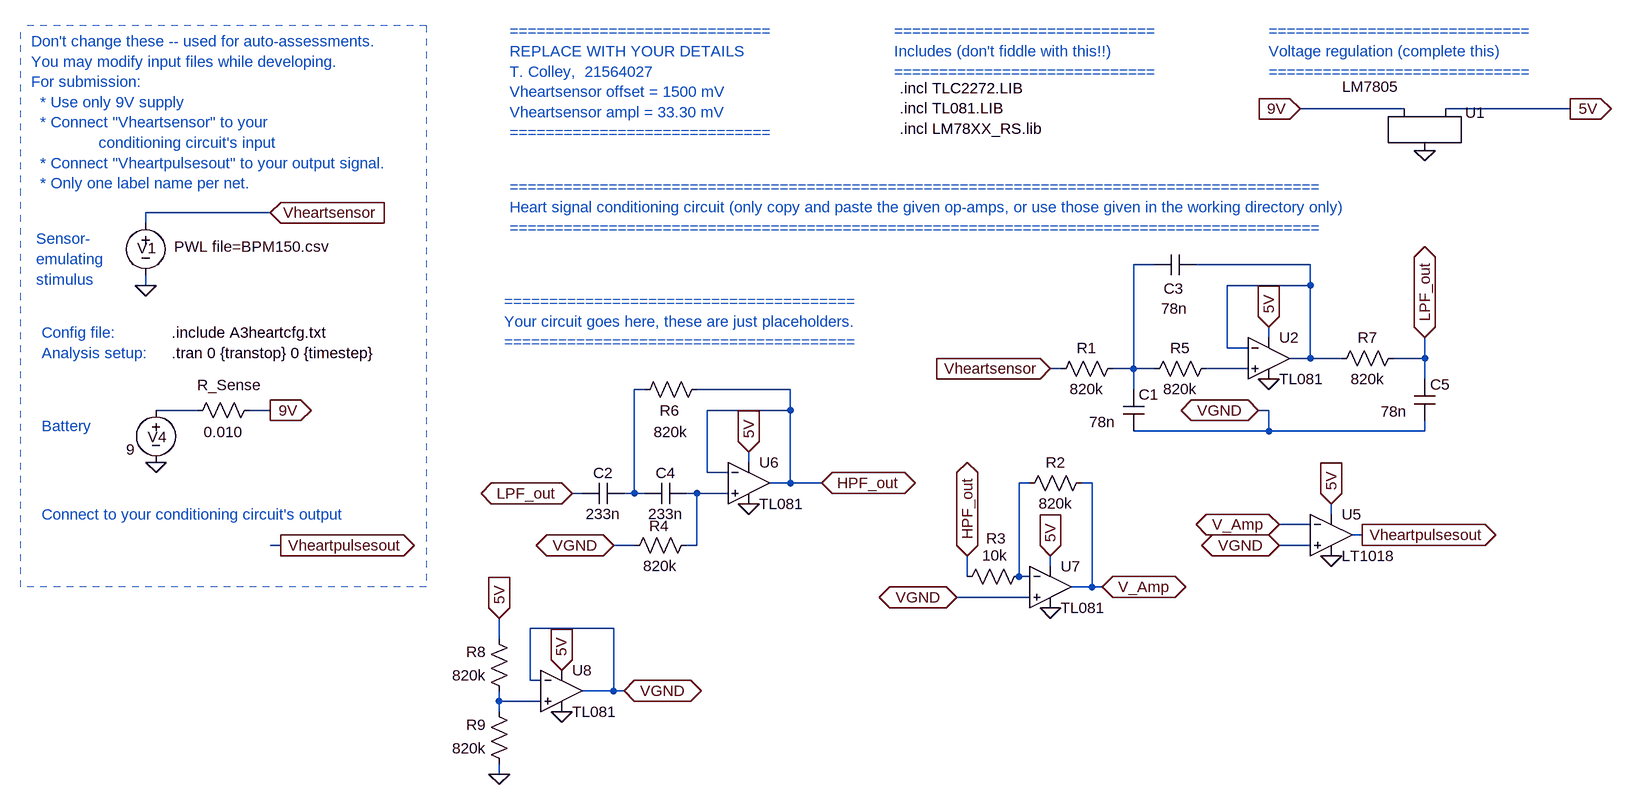
[diagram p0: schematic E344_A3_heart.asc]
E344_A3_heart.asc, the LTspice schematic file:
Version 4
SHEET 1 1824 680
WIRE -176 -1280 -336 -1280
WIRE 80 -1280 -112 -1280
WIRE -1920 -1120 -2112 -1120
WIRE -2112 -1104 -2112 -1120
WIRE -560 -1040 -592 -1040
WIRE -320 -1040 -496 -1040
WIRE -2112 -1008 -2112 -1024
WIRE -320 -1008 -320 -1040
WIRE -320 -1008 -448 -1008
WIRE -384 -928 -384 -944
WIRE -448 -912 -448 -1008
WIRE -416 -912 -448 -912
WIRE -320 -896 -320 -1008
WIRE -320 -896 -352 -896
WIRE -272 -896 -320 -896
WIRE -144 -896 -144 -928
WIRE -144 -896 -192 -896
WIRE -704 -880 -720 -880
WIRE -592 -880 -592 -1040
WIRE -592 -880 -624 -880
WIRE -560 -880 -592 -880
WIRE -416 -880 -480 -880
WIRE -144 -864 -144 -896
WIRE -1344 -848 -1360 -848
WIRE -1120 -848 -1264 -848
WIRE -592 -848 -592 -880
WIRE -2032 -816 -2096 -816
WIRE -1920 -816 -1952 -816
WIRE -1120 -816 -1120 -848
WIRE -1120 -816 -1248 -816
WIRE -384 -816 -400 -816
WIRE -384 -784 -384 -816
WIRE -384 -784 -592 -784
WIRE -144 -784 -144 -800
WIRE -144 -784 -384 -784
WIRE -1184 -736 -1184 -752
WIRE -1248 -720 -1248 -816
WIRE -1216 -720 -1248 -720
WIRE -1120 -704 -1120 -816
WIRE -1120 -704 -1152 -704
WIRE -1072 -704 -1120 -704
WIRE -752 -704 -768 -704
WIRE -656 -704 -672 -704
WIRE -1440 -688 -1456 -688
WIRE -1360 -688 -1360 -848
WIRE -1360 -688 -1376 -688
WIRE -1344 -688 -1360 -688
WIRE -1264 -688 -1280 -688
WIRE -1216 -688 -1264 -688
WIRE -288 -656 -288 -672
WIRE -320 -640 -368 -640
WIRE -240 -624 -256 -624
WIRE -1904 -608 -1920 -608
WIRE -1360 -608 -1392 -608
WIRE -1264 -608 -1264 -688
WIRE -1264 -608 -1280 -608
WIRE -320 -608 -368 -608
WIRE -720 -576 -720 -592
WIRE -848 -560 -848 -592
WIRE -768 -560 -768 -704
WIRE -752 -560 -768 -560
WIRE -656 -544 -656 -704
WIRE -656 -544 -688 -544
WIRE -640 -544 -656 -544
WIRE -752 -528 -864 -528
WIRE -1392 -480 -1520 -480
WIRE -1568 -464 -1568 -496
WIRE -1520 -400 -1520 -480
WIRE -1504 -400 -1520 -400
WIRE -1392 -384 -1392 -480
WIRE -1392 -384 -1440 -384
WIRE -1376 -384 -1392 -384
WIRE -1568 -368 -1568 -384
WIRE -1504 -368 -1568 -368
WIRE -1568 -352 -1568 -368
WIRE -1568 -256 -1568 -272
FLAG -2112 -1008 0
FLAG -1920 -1120 Vheartsensor
IOPIN -1920 -1120 In
FLAG -1920 -816 9V
IOPIN -1920 -816 Out
FLAG -2096 -736 0
FLAG -336 -1280 9V
IOPIN -336 -1280 In
FLAG -144 -1216 0
FLAG 80 -1280 5V
IOPIN 80 -1280 Out
FLAG -1904 -608 Vheartpulsesout
IOPIN -1904 -608 Out
FLAG -144 -928 LPF_out
IOPIN -144 -928 BiDir
FLAG -848 -592 HPF_out
IOPIN -848 -592 BiDir
FLAG -384 -864 0
FLAG -384 -944 5V
IOPIN -384 -944 In
FLAG -720 -512 0
FLAG -720 -592 5V
IOPIN -720 -592 In
FLAG -1072 -704 HPF_out
IOPIN -1072 -704 BiDir
FLAG -1184 -672 0
FLAG -1184 -752 5V
IOPIN -1184 -752 In
FLAG -1456 -688 LPF_out
IOPIN -1456 -688 BiDir
FLAG -640 -544 V_Amp
IOPIN -640 -544 BiDir
FLAG -288 -672 5V
IOPIN -288 -672 In
FLAG -368 -640 V_Amp
IOPIN -368 -640 BiDir
FLAG -288 -592 0
FLAG -1568 -496 5V
IOPIN -1568 -496 In
FLAG -1568 -256 0
FLAG -1376 -384 VGND
IOPIN -1376 -384 BiDir
FLAG -400 -816 VGND
IOPIN -400 -816 BiDir
FLAG -1472 -352 0
FLAG -1472 -416 5V
IOPIN -1472 -416 In
FLAG -864 -528 VGND
IOPIN -864 -528 BiDir
FLAG -1392 -608 VGND
IOPIN -1392 -608 BiDir
FLAG -368 -608 VGND
IOPIN -368 -608 BiDir
FLAG -720 -880 Vheartsensor
IOPIN -720 -880 In
FLAG -240 -624 Vheartpulsesout
IOPIN -240 -624 Out
SYMBOL voltage -2112 -1120 R0
WINDOW 123 0 0 Left 0
WINDOW 39 0 0 Left 0
WINDOW 3 44 52 Left 2
WINDOW 0 -13 54 Left 2
SYMATTR Value PWL file=BPM150.csv
SYMATTR InstName V1
SYMBOL voltage -2096 -832 R0
WINDOW 123 24 44 Left 2
WINDOW 39 0 0 Left 0
WINDOW 3 -46 76 Left 2
WINDOW 0 -13 57 Left 2
SYMATTR Value 9
SYMATTR InstName V4
SYMBOL res -1936 -832 R90
WINDOW 0 -7 47 VBottom 2
WINDOW 3 34 56 VTop 2
SYMATTR InstName R_Sense
SYMATTR Value 0.010
SYMBOL LM7805 -144 -1264 R0
WINDOW 3 -83 -66 Top 2
SYMATTR InstName U1
SYMBOL res -608 -896 R90
WINDOW 0 0 56 VBottom 2
WINDOW 3 32 56 VTop 2
SYMATTR InstName R1
SYMATTR Value 820k
SYMBOL cap -608 -848 R0
WINDOW 3 -52 50 Left 2
SYMATTR Value 78n
SYMATTR InstName C1
SYMBOL res -656 -720 R90
WINDOW 0 0 56 VBottom 2
WINDOW 3 32 56 VTop 2
SYMATTR InstName R2
SYMATTR Value 820k
SYMBOL res -752 -576 R90
WINDOW 0 -27 51 VBottom 2
WINDOW 3 -32 53 VTop 2
SYMATTR InstName R3
SYMATTR Value 10k
SYMBOL res -1376 -592 R270
WINDOW 0 30 54 VTop 2
WINDOW 3 0 56 VBottom 2
SYMATTR InstName R4
SYMATTR Value 820k
SYMBOL cap -1376 -704 R90
WINDOW 0 0 32 VBottom 2
WINDOW 3 32 32 VTop 2
SYMATTR InstName C2
SYMATTR Value 233n
SYMBOL res -464 -896 R90
WINDOW 0 0 56 VBottom 2
WINDOW 3 32 56 VTop 2
SYMATTR InstName R5
SYMATTR Value 820k
SYMBOL cap -496 -1056 R90
WINDOW 0 68 34 VBottom 2
WINDOW 3 68 33 VTop 2
SYMATTR InstName C3
SYMATTR Value 78n
SYMBOL cap -1280 -704 R90
WINDOW 0 0 32 VBottom 2
WINDOW 3 32 32 VTop 2
SYMATTR InstName C4
SYMATTR Value 233n
SYMBOL res -1360 -832 R270
WINDOW 0 -32 54 VTop 2
WINDOW 3 -34 56 VBottom 2
SYMATTR InstName R6
SYMATTR Value 820k
SYMBOL res -176 -912 R90
WINDOW 0 0 56 VBottom 2
WINDOW 3 32 56 VTop 2
SYMATTR InstName R7
SYMATTR Value 820k
SYMBOL cap -160 -864 R0
WINDOW 3 -52 50 Left 2
SYMATTR Value 78n
SYMATTR InstName C5
SYMBOL res -1552 -368 R180
WINDOW 0 36 76 Left 2
WINDOW 3 36 40 Left 2
SYMATTR InstName R8
SYMATTR Value 820k
SYMBOL res -1552 -256 R180
WINDOW 0 36 76 Left 2
WINDOW 3 36 40 Left 2
SYMATTR InstName R9
SYMATTR Value 820k
SYMBOL opamp2 -384 -960 R0
SYMATTR InstName U2
SYMATTR Value TL081
SYMATTR SpiceModel TL081
SYMBOL opamp2 -1184 -768 R0
SYMATTR InstName U6
SYMATTR Value TL081
SYMATTR SpiceModel TL081
SYMBOL opamp2 -720 -608 R0
SYMATTR InstName U7
SYMATTR Value TL081
SYMATTR SpiceModel TL081
SYMBOL opamp2 -1472 -448 R0
SYMATTR InstName U8
SYMATTR Value TL081
SYMATTR SpiceModel TL081
SYMBOL LT1018 -288 -624 R0
SYMATTR InstName U5
TEXT -2072 -904 Left 2 !.tran 0 {transtop} 0 {timestep}
TEXT -2072 -936 Left 2 !.include A3heartcfg.txt
TEXT -2288 -1384 Left 2 ;Don't change these -- used for auto-assessments.\nYou may modify input files while developing.\nFor submission: \n  * Use only 9V supply \n  * Connect "Vheartsensor" to your \n               conditioning circuit's input\n  * Connect "Vheartpulsesout" to your output signal.\n  * Only one label name per net.
TEXT -2272 -936 Left 2 ;Config file:
TEXT -2272 -904 Left 2 ;Analysis setup:
TEXT -2272 -792 Left 2 ;Battery
TEXT -2280 -1080 Left 2 ;Sensor-\nemulating \nstimulus
TEXT -1552 -1400 Left 2 ;=============================\nREPLACE WITH YOUR DETAILS\nT. Colley,  21564027\nVheartsensor offset = 1500 mV\nVheartsensor ampl = 33.30 mV\n=============================
TEXT -1552 -1160 Left 2 ;==========================================================================================\nHeart signal conditioning circuit (only copy and paste the given op-amps, or use those given in the working directory only)\n==========================================================================================
TEXT -384 -1400 Left 2 ;=============================\nVoltage regulation (complete this)\n=============================
TEXT -952 -1312 Left 2 !.incl TLC2272.LIB\n.incl TL081.LIB\n.incl LM78XX_RS.lib
TEXT -2272 -656 Left 2 ;Connect to your conditioning circuit's output
TEXT -960 -1400 Left 2 ;=============================\nIncludes (don't fiddle with this!!)\n=============================
TEXT -1560 -984 Left 2 ;=======================================\nYour circuit goes here, these are just placeholders.\n=======================================
LINE Normal -2304 -544 -2304 -1408 1
LINE Normal -1680 -1408 -1680 -544 1
LINE Normal -1680 -544 -2304 -544 1
LINE Normal -1680 -1408 -2304 -1408 1

The netlist it stands for:
* E344_A3_heart.asc
V1 Vheartsensor 0 PWL file=BPM150.csv
V4 N005 0 9
R_Sense 9V N005 0.010
XU1 9V 0 5V LM7805
R1 N001 Vheartsensor 820k
C1 N001 VGND 78n
R2 V_Amp N006 820k
R3 N006 HPF_out 10k
R4 VGND N007 820k
C2 N004 LPF_out 233n
R5 N003 N001 820k
C3 N002 N001 78n
C4 N007 N004 233n
R6 N004 HPF_out 820k
R7 LPF_out N002 820k
C5 LPF_out VGND 78n
R8 N008 5V 820k
R9 0 N008 820k
XU2 N003 N002 5V 0 N002 TL081 TL081  ; pins In+ In- V+ V- OUT
XU6 N007 HPF_out 5V 0 HPF_out TL081 TL081  ; pins In+ In- V+ V- OUT
XU7 VGND N006 5V 0 V_Amp TL081 TL081  ; pins In+ In- V+ V- OUT
XU8 N008 VGND 5V 0 VGND TL081 TL081  ; pins In+ In- V+ V- OUT
XU5 VGND V_Amp 5V 0 Vheartpulsesout LT1018  ; pins In+ In- V+ V- OUT
.tran 0 {transtop} 0 {timestep}
.include A3heartcfg.txt
* Don't change these -- used for auto-assessments.
* You may modify input files while developing.
* For submission:
*   * Use only 9V supply
*   * Connect "Vheartsensor" to your
*                conditioning circuit's input
*   * Connect "Vheartpulsesout" to your output signal.
*   * Only one label name per net.
* Config file:
* Analysis setup:
* Battery
* Sensor-
* emulating
* stimulus
* =============================
* REPLACE WITH YOUR DETAILS
* T. Colley,  21564027
* Vheartsensor offset = 1500 mV
* Vheartsensor ampl = 33.30 mV
* =============================
* ==========================================================================================
* Heart signal conditioning circuit (only copy and paste the given op-amps, or use those given in the working directory only)
* ==========================================================================================
* =============================
* Voltage regulation (complete this)
* =============================
.incl TLC2272.LIB
.incl TL081.LIB
.incl LM78XX_RS.lib
* Connect to your conditioning circuit's output
* =============================
* Includes (don't fiddle with this!!)
* =============================
* =======================================
* Your circuit goes here, these are just placeholders.
* =======================================
.lib LTC1.lib
.backanno
.end